# Altium schematic sheet GBEthernet.SchDoc: BaseBand Front-End
size A3; Revision: 1; SheetNumber: 6
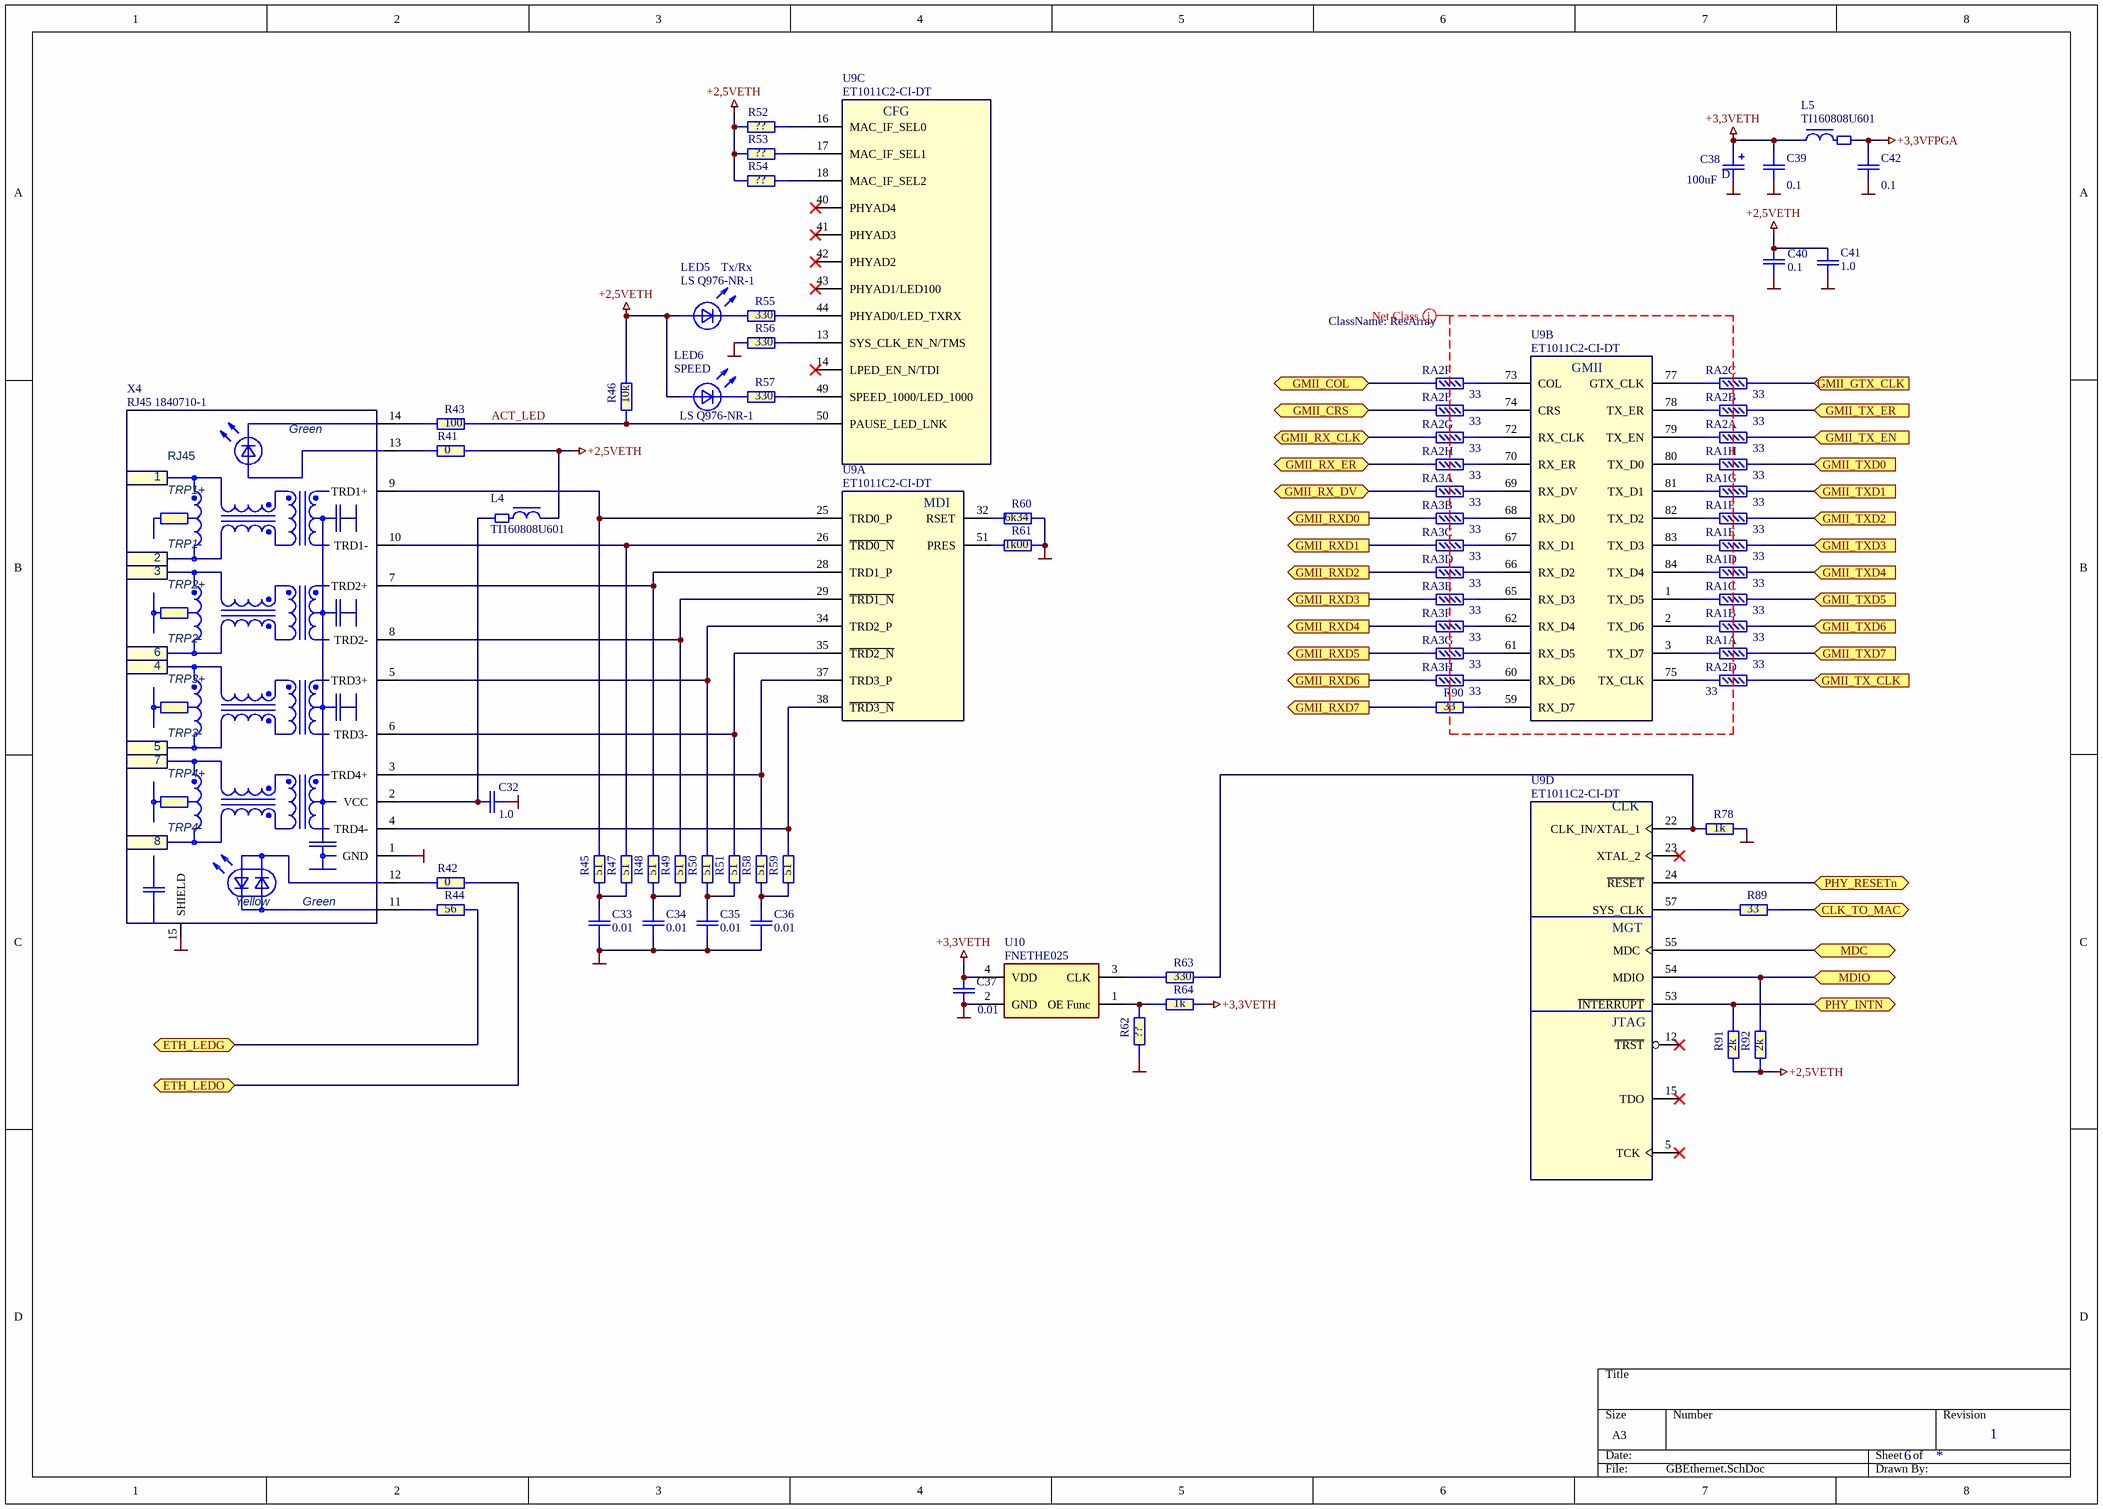
[diagram p0: GBEthernet.SchDoc]

## Parts
C32  1.0  [C0603-PHILLIPS]
C33  0.01  [C0402-Phillips]
C34  0.01  [C0402-Phillips]
C35  0.01  [C0402-Phillips]
C36  0.01  [C0402-Phillips]
C37  0.01  [C0402-Phillips]
C38  100uF  [cd7343]
C39  0.1  [C0402-Phillips]
C40  0.1  [C0402-Phillips]
C41  1.0  [C0603-PHILLIPS]
C42  0.1  [C0402-Phillips]
L4  TI160808U601  [Ti160808-Phillips]
L5  TI160808U601  [Ti160808-Phillips]
LED5  LS Q976-NR-1  Misc: Tx/Rx  [LED-0603y]
LED6  LS Q976-NR-1  Misc: SPEED  [LED-0603y]
R41  0  [R0603-PHILLIPS]
R42  0  [R0603-PHILLIPS]
R43  100  [R0603-PHILLIPS]
R44  56  [R0603-PHILLIPS]
R45  51  [R0603-PHILLIPS]
R46  10k  [R0603-PHILLIPS]
R47  51  [R0603-PHILLIPS]
R48  51  [R0603-PHILLIPS]
R49  51  [R0603-PHILLIPS]
R50  51  [R0603-PHILLIPS]
R51  51  [R0603-PHILLIPS]
R52  ??  [R0603-PHILLIPS]
R53  ??  [R0603-PHILLIPS]
R54  ??  [R0603-PHILLIPS]
R55  330  [R0603-PHILLIPS]
R56  330  [R0603-PHILLIPS]
R57  330  [R0603-PHILLIPS]
R58  51  [R0603-PHILLIPS]
R59  51  [R0603-PHILLIPS]
R60  6k34  [R0603-PHILLIPS]
R61  1k00  [R0603-PHILLIPS]
R62  ??  [R0603-PHILLIPS]
R63  330  [R0603-PHILLIPS]
R64  1k  [R0603-PHILLIPS]
R78  1k  [R0603-PHILLIPS]
R89  33  [R0603-PHILLIPS]
R90  33  [R0603-PHILLIPS]
R91  2k  [R0603-PHILLIPS]
R92  2k  [R0603-PHILLIPS]
RA1  33  [YC248]  (parts A,B,C,D,E,F,G,H of 8)
RA2  33  [YC248]  (parts A,B,C,D,E,F,G,H of 8)
RA3  33  [YC248]  (parts A,B,C,D,E,F,G,H of 8)
U9  ET1011C2-CI-DT  [QFN-84(10x10/0/4mm)with_pad]  (parts A,B,C,D of 5)
U10  FNETHE025  [7x5mm]
X4  RJ45 1840710-1  [RJ45 1840710-x]

## Ports
CLK_TO_MAC, ETH_LEDG, ETH_LEDO, GMII_COL, GMII_CRS, GMII_GTX_CLK (in), GMII_RX_CLK, GMII_RX_DV, GMII_RX_ER, GMII_RXD0 (out), GMII_RXD1 (out), GMII_RXD2 (out), GMII_RXD3 (out), GMII_RXD4 (out), GMII_RXD5 (out), GMII_RXD6 (out), GMII_RXD7 (out), GMII_TX_CLK (in), GMII_TX_EN (in), GMII_TX_ER (in), GMII_TXD0 (in), GMII_TXD1 (in), GMII_TXD2 (in), GMII_TXD3 (in), GMII_TXD4 (in), GMII_TXD5 (in), GMII_TXD6 (in), GMII_TXD7 (in), MDC, MDIO, PHY_INTN, PHY_RESETn

## Nets
+2,5VETH: C40.1 C41.2 L4.1 LED5.2(A) LED6.2(A) R41.2 R46.2 R52.1 R53.1 R54.1 R91.1 R92.1
+3,3VETH: C37.1 C38.1(+) C39.1 L5.1 R64.2 U10.4(VDD)
+3,3VFPGA: C42.1 L5.2
GND: C32.1 C33.2 C34.2 C35.2 C36.2 C37.2 C38.2(-) C39.2 C40.2 C41.1 C42.2 R56.1 R60.2 R61.2 R62.1 R78.2 U10.2(GND) X4.1(GND) X4.15(SHIELD)
ACT_LED: R43.2 R46.1 U9.50(PAUSE_LED_LNK)
CLK_TO_MAC: R89.2 ; port CLK_TO_MAC
ETH_LEDG: R44.2 ; port ETH_LEDG
ETH_LEDO: R42.2 ; port ETH_LEDO
GMII_COL: RA2.11 ; port GMII_COL
GMII_CRS: RA2.12 ; port GMII_CRS
GMII_GTX_CLK: RA2.14 ; port GMII_GTX_CLK
GMII_RX_CLK: RA2.10 ; port GMII_RX_CLK
GMII_RX_DV: RA3.16 ; port GMII_RX_DV
GMII_RX_ER: RA2.9 ; port GMII_RX_ER
GMII_RXD0: RA3.15 ; port GMII_RXD0
GMII_RXD1: RA3.14 ; port GMII_RXD1
GMII_RXD2: RA3.13 ; port GMII_RXD2
GMII_RXD3: RA3.12 ; port GMII_RXD3
GMII_RXD4: RA3.11 ; port GMII_RXD4
GMII_RXD5: RA3.10 ; port GMII_RXD5
GMII_RXD6: RA3.9 ; port GMII_RXD6
GMII_RXD7: R90.1 ; port GMII_RXD7
GMII_TX_CLK: RA2.13 ; port GMII_TX_CLK
GMII_TX_EN: RA2.16 ; port GMII_TX_EN
GMII_TX_ER: RA2.15 ; port GMII_TX_ER
GMII_TXD0: RA1.9 ; port GMII_TXD0
GMII_TXD1: RA1.10 ; port GMII_TXD1
GMII_TXD2: RA1.11 ; port GMII_TXD2
GMII_TXD3: RA1.12 ; port GMII_TXD3
GMII_TXD4: RA1.13 ; port GMII_TXD4
GMII_TXD5: RA1.14 ; port GMII_TXD5
GMII_TXD6: RA1.15 ; port GMII_TXD6
GMII_TXD7: RA1.16 ; port GMII_TXD7
MDC: U9.55(MDC) ; port MDC
MDIO: R92.2 U9.54(MDIO) ; port MDIO
PHY_INTN: R91.2 U9.53(~{INTERRUPT}) ; port PHY_INTN
PHY_RESETn: U9.24(~{RESET}) ; port PHY_RESETn
NetC32_2: C32.2 L4.2 X4.2(VCC)
NetC33_1: C33.1 R45.1 R47.1
NetC34_1: C34.1 R48.1 R49.1
NetC35_1: C35.1 R50.1 R51.1
NetC36_1: C36.1 R58.1 R59.1
NetLED5_1: LED5.1(K) R55.1
NetLED6_1: LED6.1(K) R57.1
NetR41_1: R41.1 X4.13(LED1+)
NetR42_1: R42.1 X4.12(LED2+Y)
NetR43_1: R43.1 X4.14(LED1-)
NetR44_1: R44.1 X4.11(LED2+G)
NetR45_2: R45.2 U9.25(TRD0_P) X4.9(TRD1+)
NetR47_2: R47.2 U9.26(~{TRD0_N}) X4.10(TRD1-)
NetR48_2: R48.2 U9.28(TRD1_P) X4.7(TRD2+)
NetR49_2: R49.2 U9.29(~{TRD1_N}) X4.8(TRD2-)
NetR50_2: R50.2 U9.34(TRD2_P) X4.5(TRD3+)
NetR51_2: R51.2 U9.35(~{TRD2_N}) X4.6(TRD3-)
NetR52_2: R52.2 U9.16(MAC_IF_SEL0)
NetR53_2: R53.2 U9.17(MAC_IF_SEL1)
NetR54_2: R54.2 U9.18(MAC_IF_SEL2)
NetR55_2: R55.2 U9.44(PHYAD0/LED_TXRX)
NetR56_2: R56.2 U9.13(SYS_CLK_EN_N/TMS)
NetR57_2: R57.2 U9.49(SPEED_1000/LED_1000)
NetR58_2: R58.2 U9.37(TRD3_P) X4.3(TRD4+)
NetR59_2: R59.2 U9.38(~{TRD3_N}) X4.4(TRD4-)
NetR60_1: R60.1 U9.32(RSET)
NetR61_1: R61.1 U9.51(PRES)
NetR62_2: R62.2 R64.1 U10.1(OE_Func)
NetR63_1: R63.1 U10.3(CLK)
NetR63_2: R63.2 R78.1 U9.22(CLK_IN/XTAL_1)
NetR89_1: R89.1 U9.57(SYS_CLK)
NetR90_2: R90.2 U9.59(RX_D7)
NetRA1_1: RA1.1 U9.3(TX_D7)
NetRA1_2: RA1.2 U9.2(TX_D6)
NetRA1_3: RA1.3 U9.1(TX_D5)
NetRA1_4: RA1.4 U9.84(TX_D4)
NetRA1_5: RA1.5 U9.83(TX_D3)
NetRA1_6: RA1.6 U9.82(TX_D2)
NetRA1_7: RA1.7 U9.81(TX_D1)
NetRA1_8: RA1.8 U9.80(TX_D0)
NetRA2_1: RA2.1 U9.79(TX_EN)
NetRA2_2: RA2.2 U9.78(TX_ER)
NetRA2_3: RA2.3 U9.77(GTX_CLK)
NetRA2_4: RA2.4 U9.75(TX_CLK)
NetRA2_5: RA2.5 U9.74(CRS)
NetRA2_6: RA2.6 U9.73(COL)
NetRA2_7: RA2.7 U9.72(RX_CLK)
NetRA2_8: RA2.8 U9.70(RX_ER)
NetRA3_1: RA3.1 U9.69(RX_DV)
NetRA3_2: RA3.2 U9.68(RX_D0)
NetRA3_3: RA3.3 U9.67(RX_D1)
NetRA3_4: RA3.4 U9.66(RX_D2)
NetRA3_5: RA3.5 U9.65(RX_D3)
NetRA3_6: RA3.6 U9.62(RX_D4)
NetRA3_7: RA3.7 U9.61(RX_D5)
NetRA3_8: RA3.8 U9.60(RX_D6)

Not connected (* = marked no-connect by the designer): U9 5(TCK)* 12(~{TRST})* 14(LPED_EN_N/TDI)* 15(TDO)* 23(XTAL_2)* 40(PHYAD4)* 41(PHYAD3)* 42(PHYAD2)* 43(PHYAD1/LED100)*

## Layout directives
net class ResArray: (no net found under the mark)

## Notes on the sheet
- (in symbol CD7343) D
- (in symbol ET1011C2-CI-DT, part A) MDI
- (in symbol ET1011C2-CI-DT, part B) GMII
- (in symbol ET1011C2-CI-DT, part C) CFG
- (in symbol ET1011C2-CI-DT, part D) CLK; MGT; JTAG
- (in symbol RJ45 1840710-5) Green; RJ45; TRP1+; TRP1-; TRP2+; TRP2-; TRP3+; TRP3-; TRP4+; TRP4-; Yellow

## Library data of the parts
C32 C41 = C0603: Конденсатор; Manufacturer: MURATA; Tolerance: 20%; Name: SMD0603; U/P/TKE: Y5V; Value: 1.0
C33-C37 C39 C40 C42 = C0402: Конденсатор; Manufacturer: MURATA; Tolerance: 20%; Name: SMD0402; U/P/TKE: Y5V
  C33-C37: Value: 0.01
  C39 C40 C42: Value: 0.1
C38 = CD7343: Конденсатор; Manufacturer: SPRAGUE; Name: CASE-G; U/P/TKE: 16V; Value: 100uF
L4 L5 = TI160808: Дроссель ЭМС; Manufacturer: MURATA; Name: TI160808U601; Value: *
LED5 LED6 = LED0603: Светодиод; Manufacturer: OSRAM Opto Semiconductors Inc; Name: LS Q976-NR-1
R41-R59 R62-R64 R78 R89-R92 = R0603: Резистор; Manufacturer: YAGEO; Tolerance: 5%; Name: SMD0603; U/P/TKE: 0.1W
  R41 R42: Value: 0
  R43: Value: 100
  R44: Value: 56
  R45 R47-R51 R58 R59: Value: 51
  R46: Value: 10k
  R52-R54 R62: Value: ??
  R55-R57 R63: Value: 330
  R64 R78: Value: 1k
  R89 R90: Value: 33
  R91 R92: Value: 2k
R60 R61 = R0603: Резистор; Manufacturer: YAGEO; Tolerance: 1%; Name: SMD0603; U/P/TKE: 0.1W
  R60: Value: 6k34
  R61: Value: 1k00
RA1-RA3 = YC248: Резисторная сборка; Manufacturer: Yageo; Misc: Резисторная сборка 8 шт. шаг 0.5 мм; U/P/TKE: 0.062W; Tolerance: 5%; Value: 33; Name: YC248
U9 = ET1011C2-CI-DT: Микросхема; Manufacturer: LSI; PDF: d:\Proj\Components\LSI\Si5330.pdf; Misc: Gigabit Ethernet Transceiver; Name: ET1011C2-CI-DT
U10 = FNETHE025: Генератор; Manufacturer: Saronix-eCera; Swap: No; PDF: d:\Proj\Components\Разное\FNETHE025.pdf; Misc: Low-Jitter 25MHz Gbe XO; Name: FNETHE025
X4 = RJ45 1840710-5: Модуль разъёма RJ45; Manufacturer: Tyco Electronics AMP; Name: RJ45 1840710-1